# EAGLE design BIM power supply (EAGLE 5.12)
DATABASE: ../../../../Component-libraries/partsdb.txt; PARTNO: 282836-2

## Sheet 1 of 5
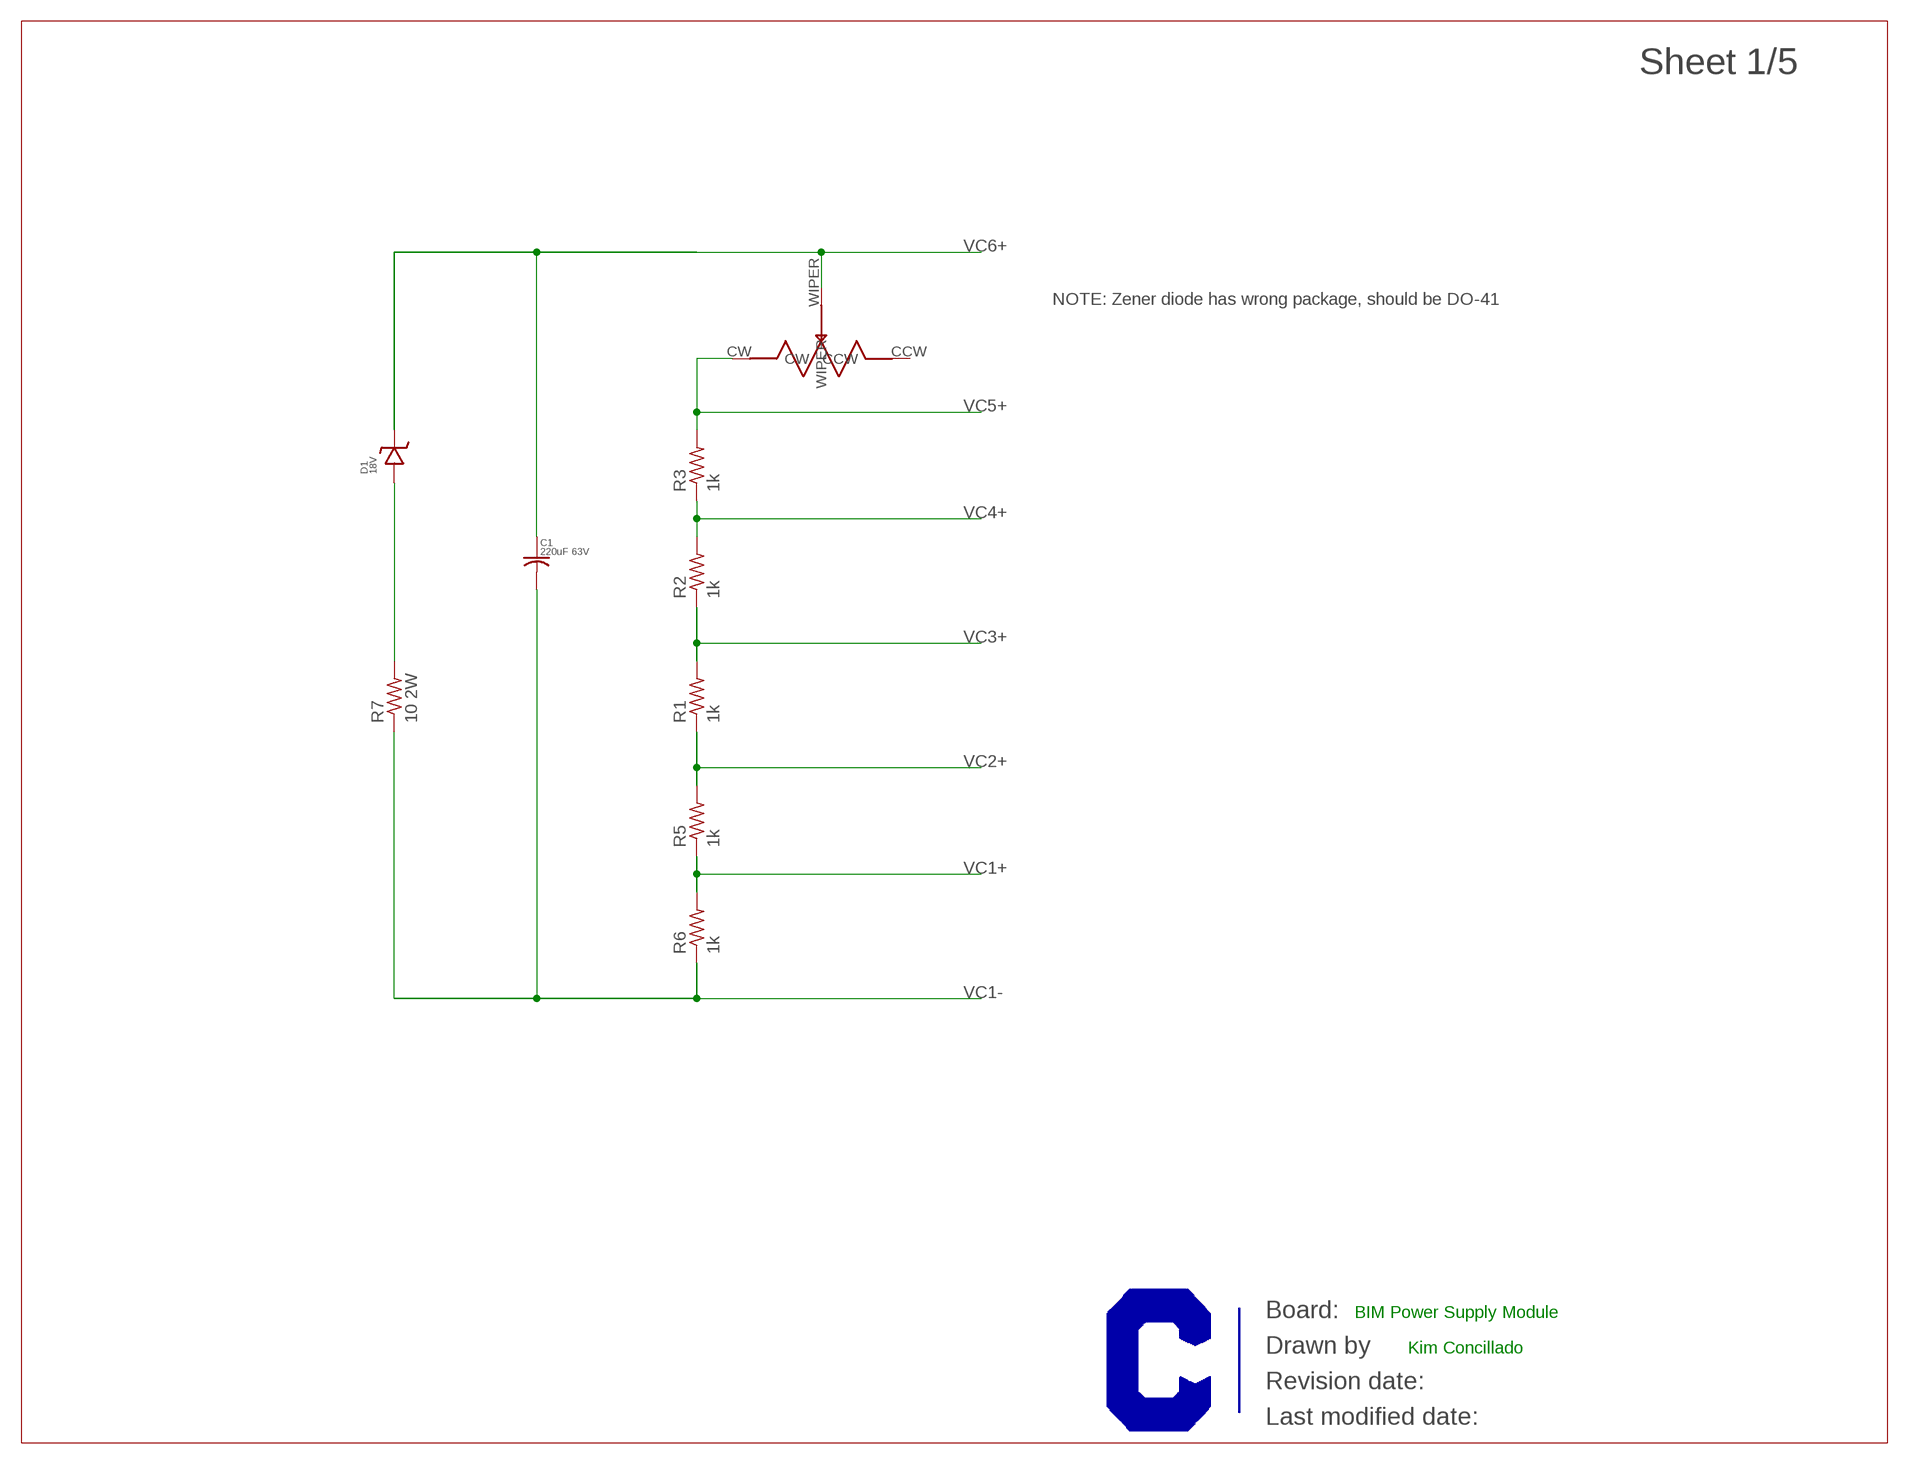
[diagram p0: schematic, sheet 1]

### Parts
C1  220uF 63V  C-US050-100X160  [C050-100X160]
D1  18V  ZENER_DIODE-DO-41  [DO-41]
R1  1k  R-US_R0603  [R0603]
R2  1k  R-US_R0603  [R0603]
R3  1k  R-US_R0603  [R0603]
R5  1k  R-US_R0603  [R0603]
R6  1k  R-US_R0603  [R0603]
R7  10 2W  R-US_0617/17  [0617/17]
U$1  CURRENT-C-LETTER-LANDSCAPE  [BLANK]
U$7  3362P-103LF-ND  [3362P-103LF-ND_THROUGH_HOLE]

### Nets
N$8: D1.ANODE R7.2
VC1+: R5.1 R6.2 ; also sheet 5
VC1-: C1.CATHODE R6.1 R7.1 ; also sheet 5
VC2+: R1.1 R5.2 ; also sheet 5
VC3+: R1.2 R2.1 ; also sheet 5
VC4+: R2.2 R3.1 ; also sheet 5
VC5+: R3.2 U$7.CW ; also sheet 5
VC6+: C1.ANODE D1.CATHODE U$7.WIPER ; also sheet 2,5
Unconnected: U$7.CCW

### Notes on the sheet
- NOTE: Zener diode has wrong package, should be DO-41
- BIM Power Supply Module
- Kim Concillado

## Sheet 2 of 5
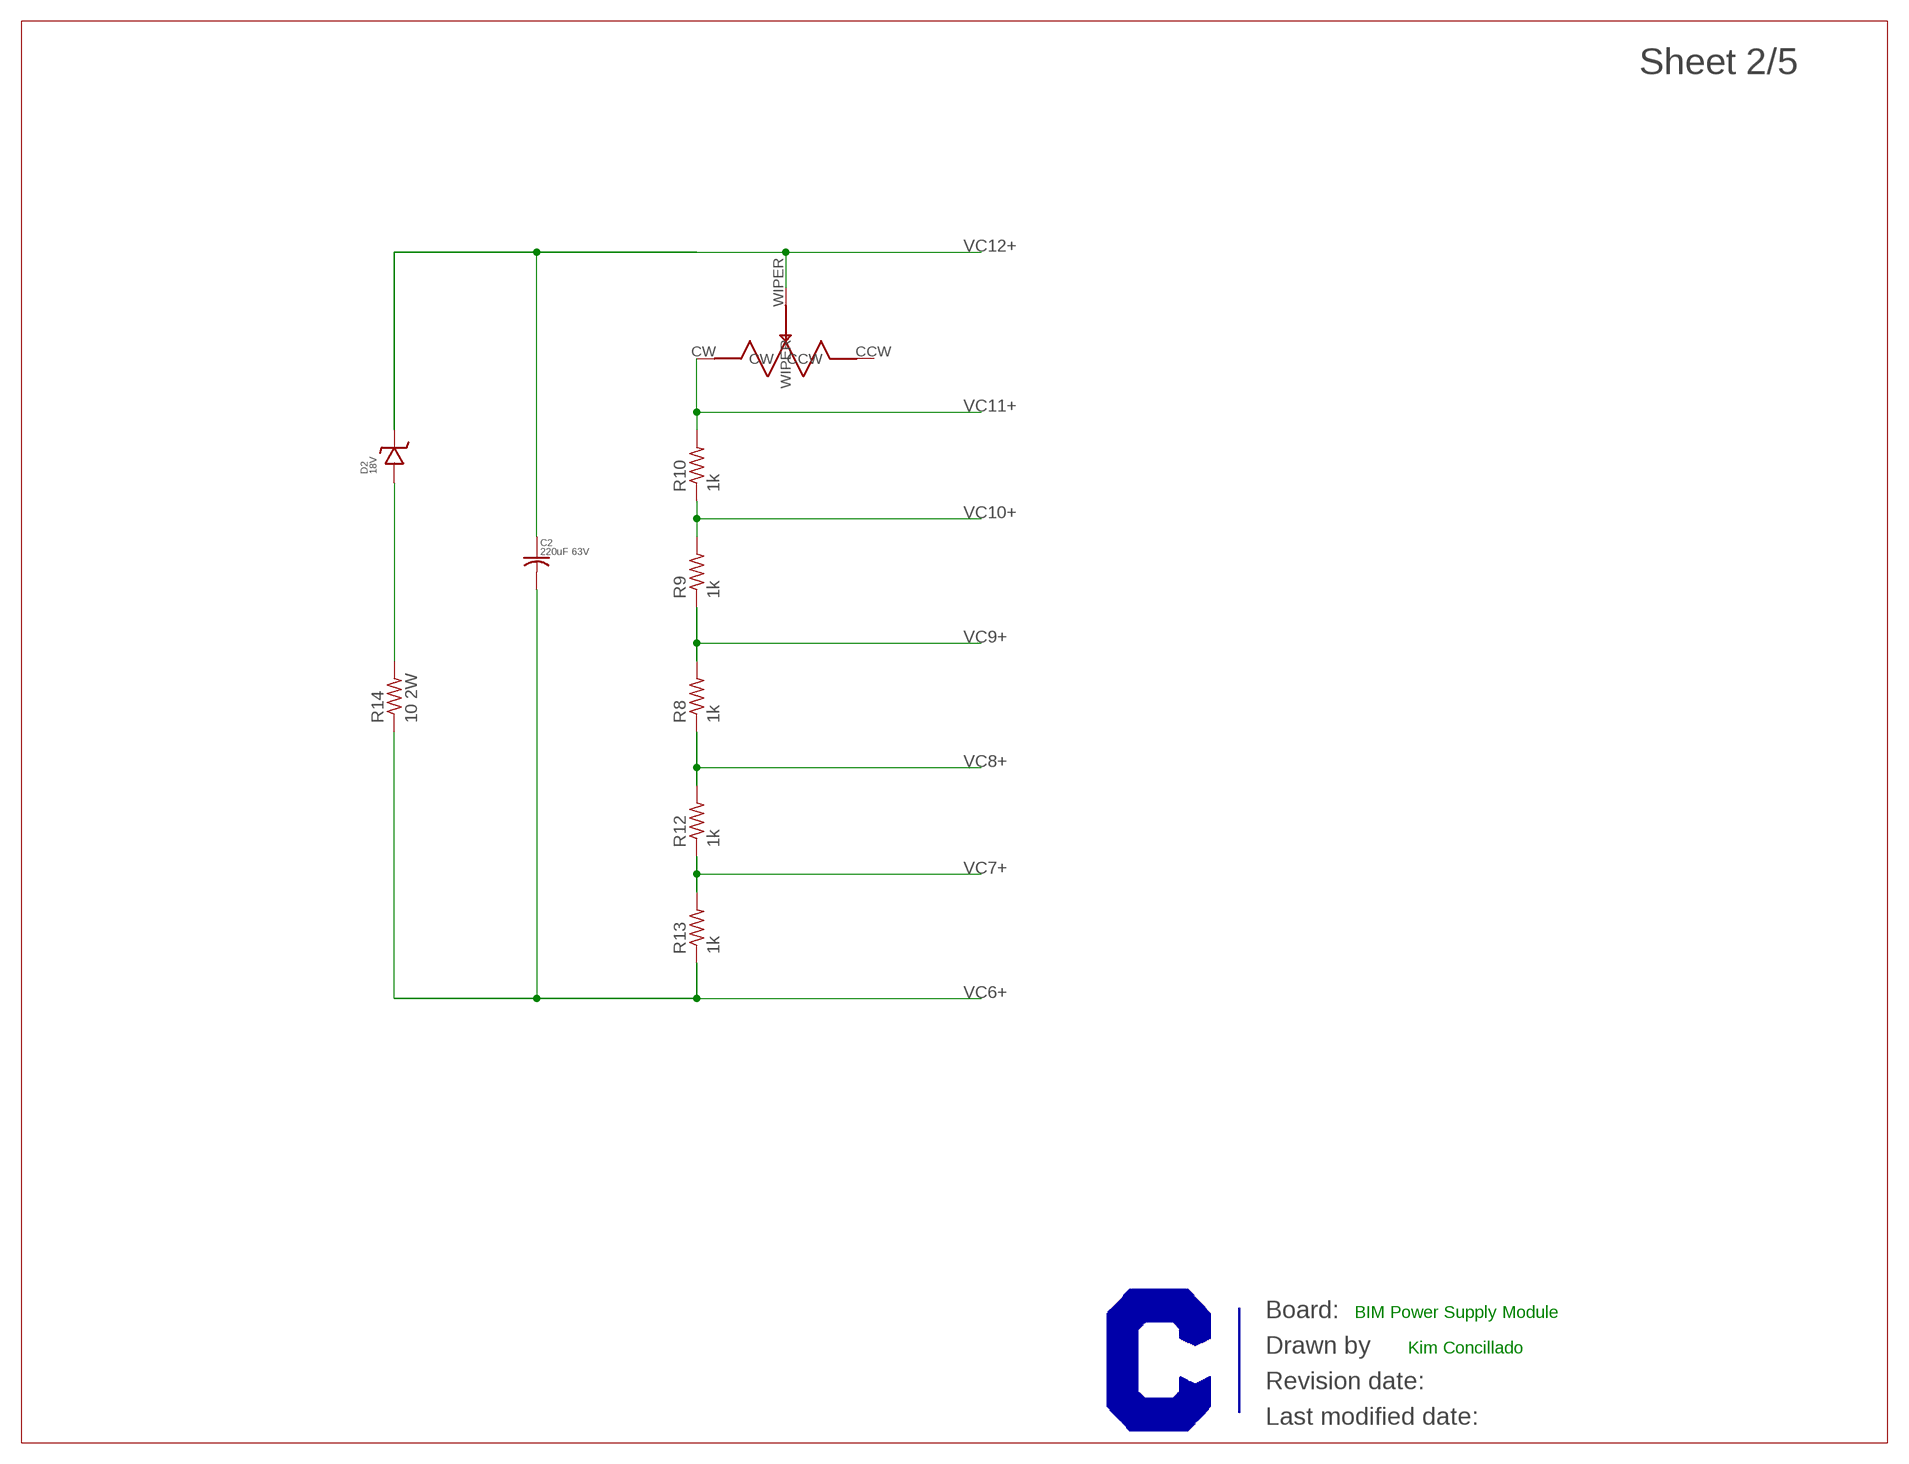
[diagram p1: schematic, sheet 2]

### Parts
C2  220uF 63V  C-US050-100X160  [C050-100X160]
D2  18V  ZENER_DIODE-DO-41  [DO-41]
R8  1k  R-US_R0603  [R0603]
R9  1k  R-US_R0603  [R0603]
R10  1k  R-US_R0603  [R0603]
R12  1k  R-US_R0603  [R0603]
R13  1k  R-US_R0603  [R0603]
R14  10 2W  R-US_0617/17  [0617/17]
U$2  CURRENT-C-LETTER-LANDSCAPE  [BLANK]
U$8  3362P-103LF-ND  [3362P-103LF-ND_THROUGH_HOLE]

### Nets
N$1: D2.ANODE R14.2
VC6+: C2.CATHODE R13.1 R14.1 ; also sheet 1,5
VC7+: R12.1 R13.2 ; also sheet 5
VC8+: R8.1 R12.2 ; also sheet 5
VC9+: R8.2 R9.1 ; also sheet 5
VC10+: R9.2 R10.1 ; also sheet 5
VC11+: R10.2 U$8.CW ; also sheet 5
VC12+: C2.ANODE D2.CATHODE U$8.WIPER ; also sheet 3,5
Unconnected: U$8.CCW

### Notes on the sheet
- BIM Power Supply Module
- Kim Concillado

## Sheet 3 of 5
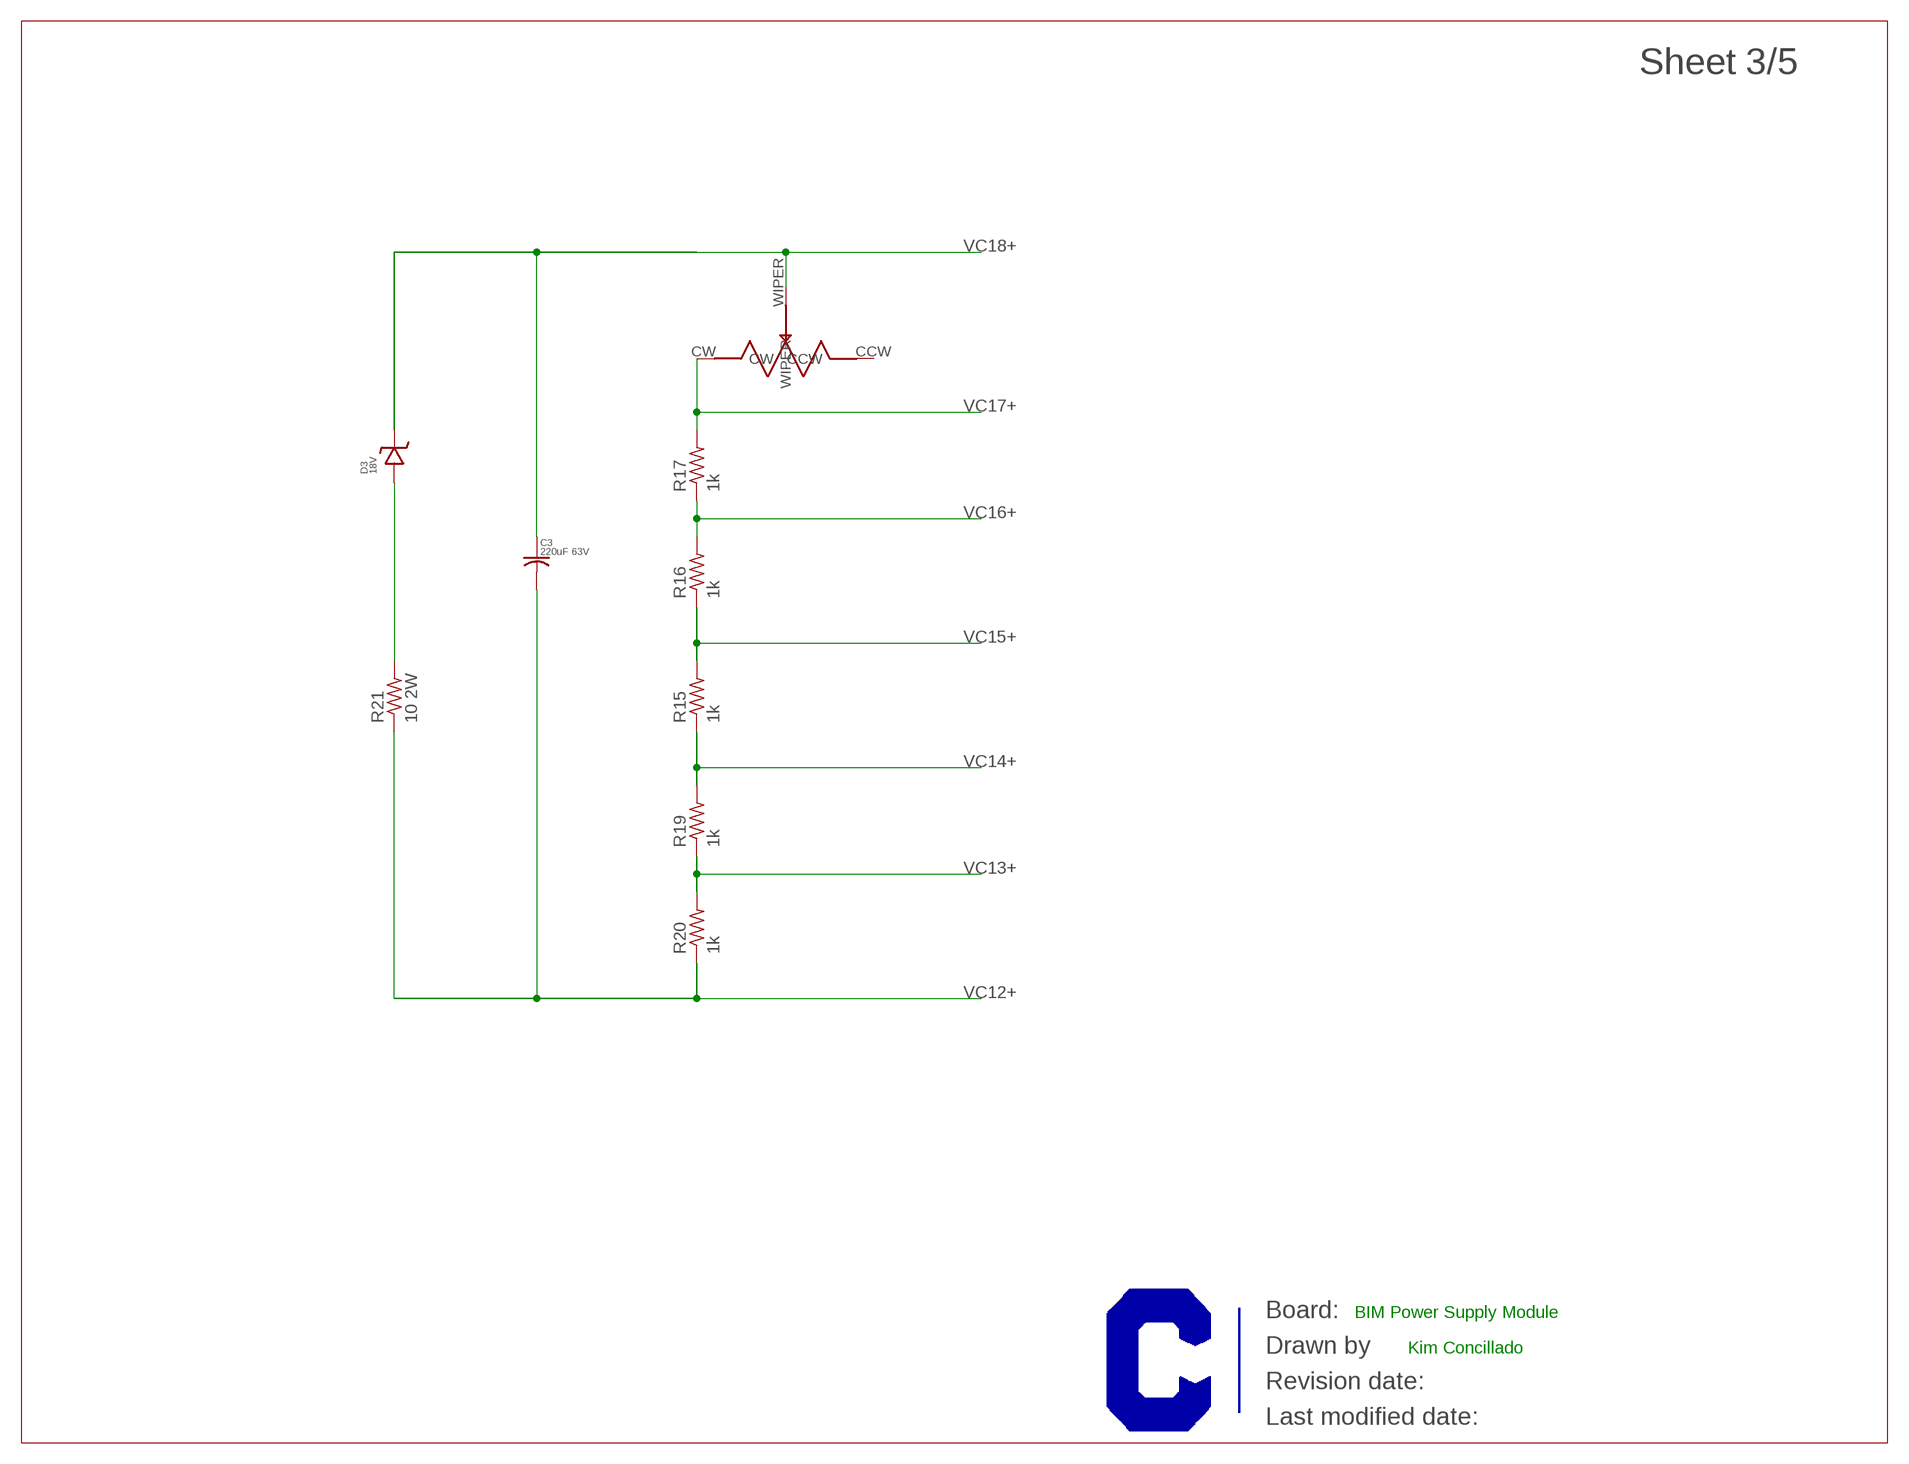
[diagram p2: schematic, sheet 3]

### Parts
C3  220uF 63V  C-US050-100X160  [C050-100X160]
D3  18V  ZENER_DIODE-DO-41  [DO-41]
R15  1k  R-US_R0603  [R0603]
R16  1k  R-US_R0603  [R0603]
R17  1k  R-US_R0603  [R0603]
R19  1k  R-US_R0603  [R0603]
R20  1k  R-US_R0603  [R0603]
R21  10 2W  R-US_0617/17  [0617/17]
U$3  CURRENT-C-LETTER-LANDSCAPE  [BLANK]
U$6  3362P-103LF-ND  [3362P-103LF-ND_THROUGH_HOLE]

### Nets
N$2: D3.ANODE R21.2
VC12+: C3.CATHODE R20.1 R21.1 ; also sheet 2,5
VC13+: R19.1 R20.2 ; also sheet 5
VC14+: R15.1 R19.2 ; also sheet 5
VC15+: R15.2 R16.1 ; also sheet 5
VC16+: R16.2 R17.1 ; also sheet 5
VC17+: R17.2 U$6.CW ; also sheet 5
VC18+: C3.ANODE D3.CATHODE U$6.WIPER ; also sheet 4,5
Unconnected: U$6.CCW

### Notes on the sheet
- BIM Power Supply Module
- Kim Concillado

## Sheet 4 of 5
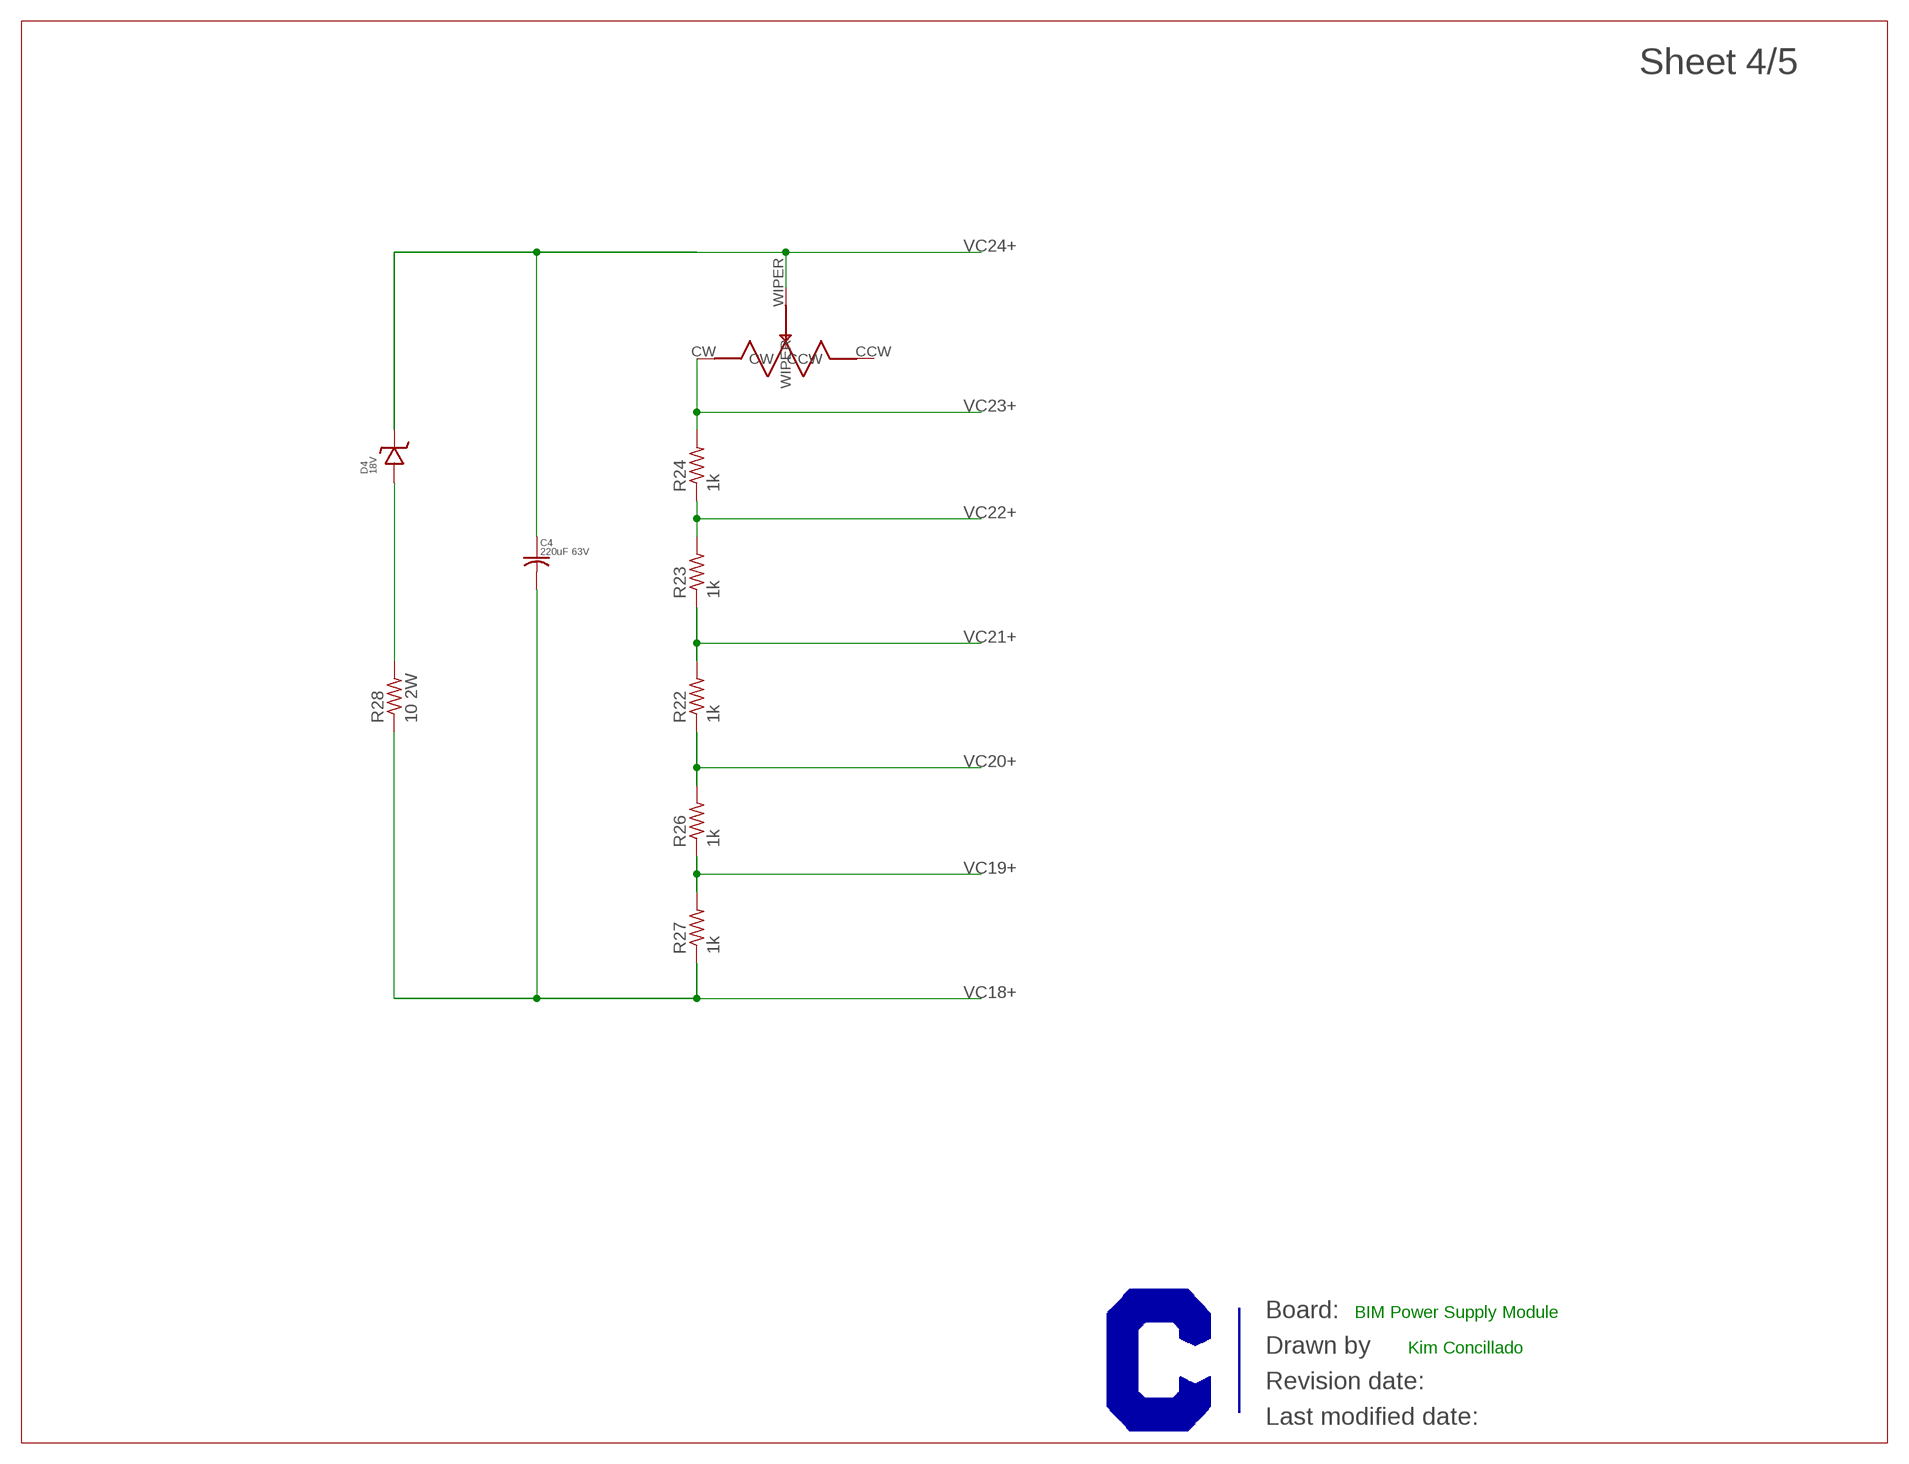
[diagram p3: schematic, sheet 4]

### Parts
C4  220uF 63V  C-US050-100X160  [C050-100X160]
D4  18V  ZENER_DIODE-DO-41  [DO-41]
R22  1k  R-US_R0603  [R0603]
R23  1k  R-US_R0603  [R0603]
R24  1k  R-US_R0603  [R0603]
R26  1k  R-US_R0603  [R0603]
R27  1k  R-US_R0603  [R0603]
R28  10 2W  R-US_0617/17  [0617/17]
U$4  CURRENT-C-LETTER-LANDSCAPE  [BLANK]
U$10  3362P-103LF-ND  [3362P-103LF-ND_THROUGH_HOLE]

### Nets
N$3: D4.ANODE R28.2
VC18+: C4.CATHODE R27.1 R28.1 ; also sheet 3,5
VC19+: R26.1 R27.2 ; also sheet 5
VC20+: R22.1 R26.2 ; also sheet 5
VC21+: R22.2 R23.1 ; also sheet 5
VC22+: R23.2 R24.1 ; also sheet 5
VC23+: R24.2 U$10.CW ; also sheet 5
VC24+: C4.ANODE D4.CATHODE U$10.WIPER ; also sheet 5
Unconnected: U$10.CCW

### Notes on the sheet
- BIM Power Supply Module
- Kim Concillado

## Sheet 5 of 5
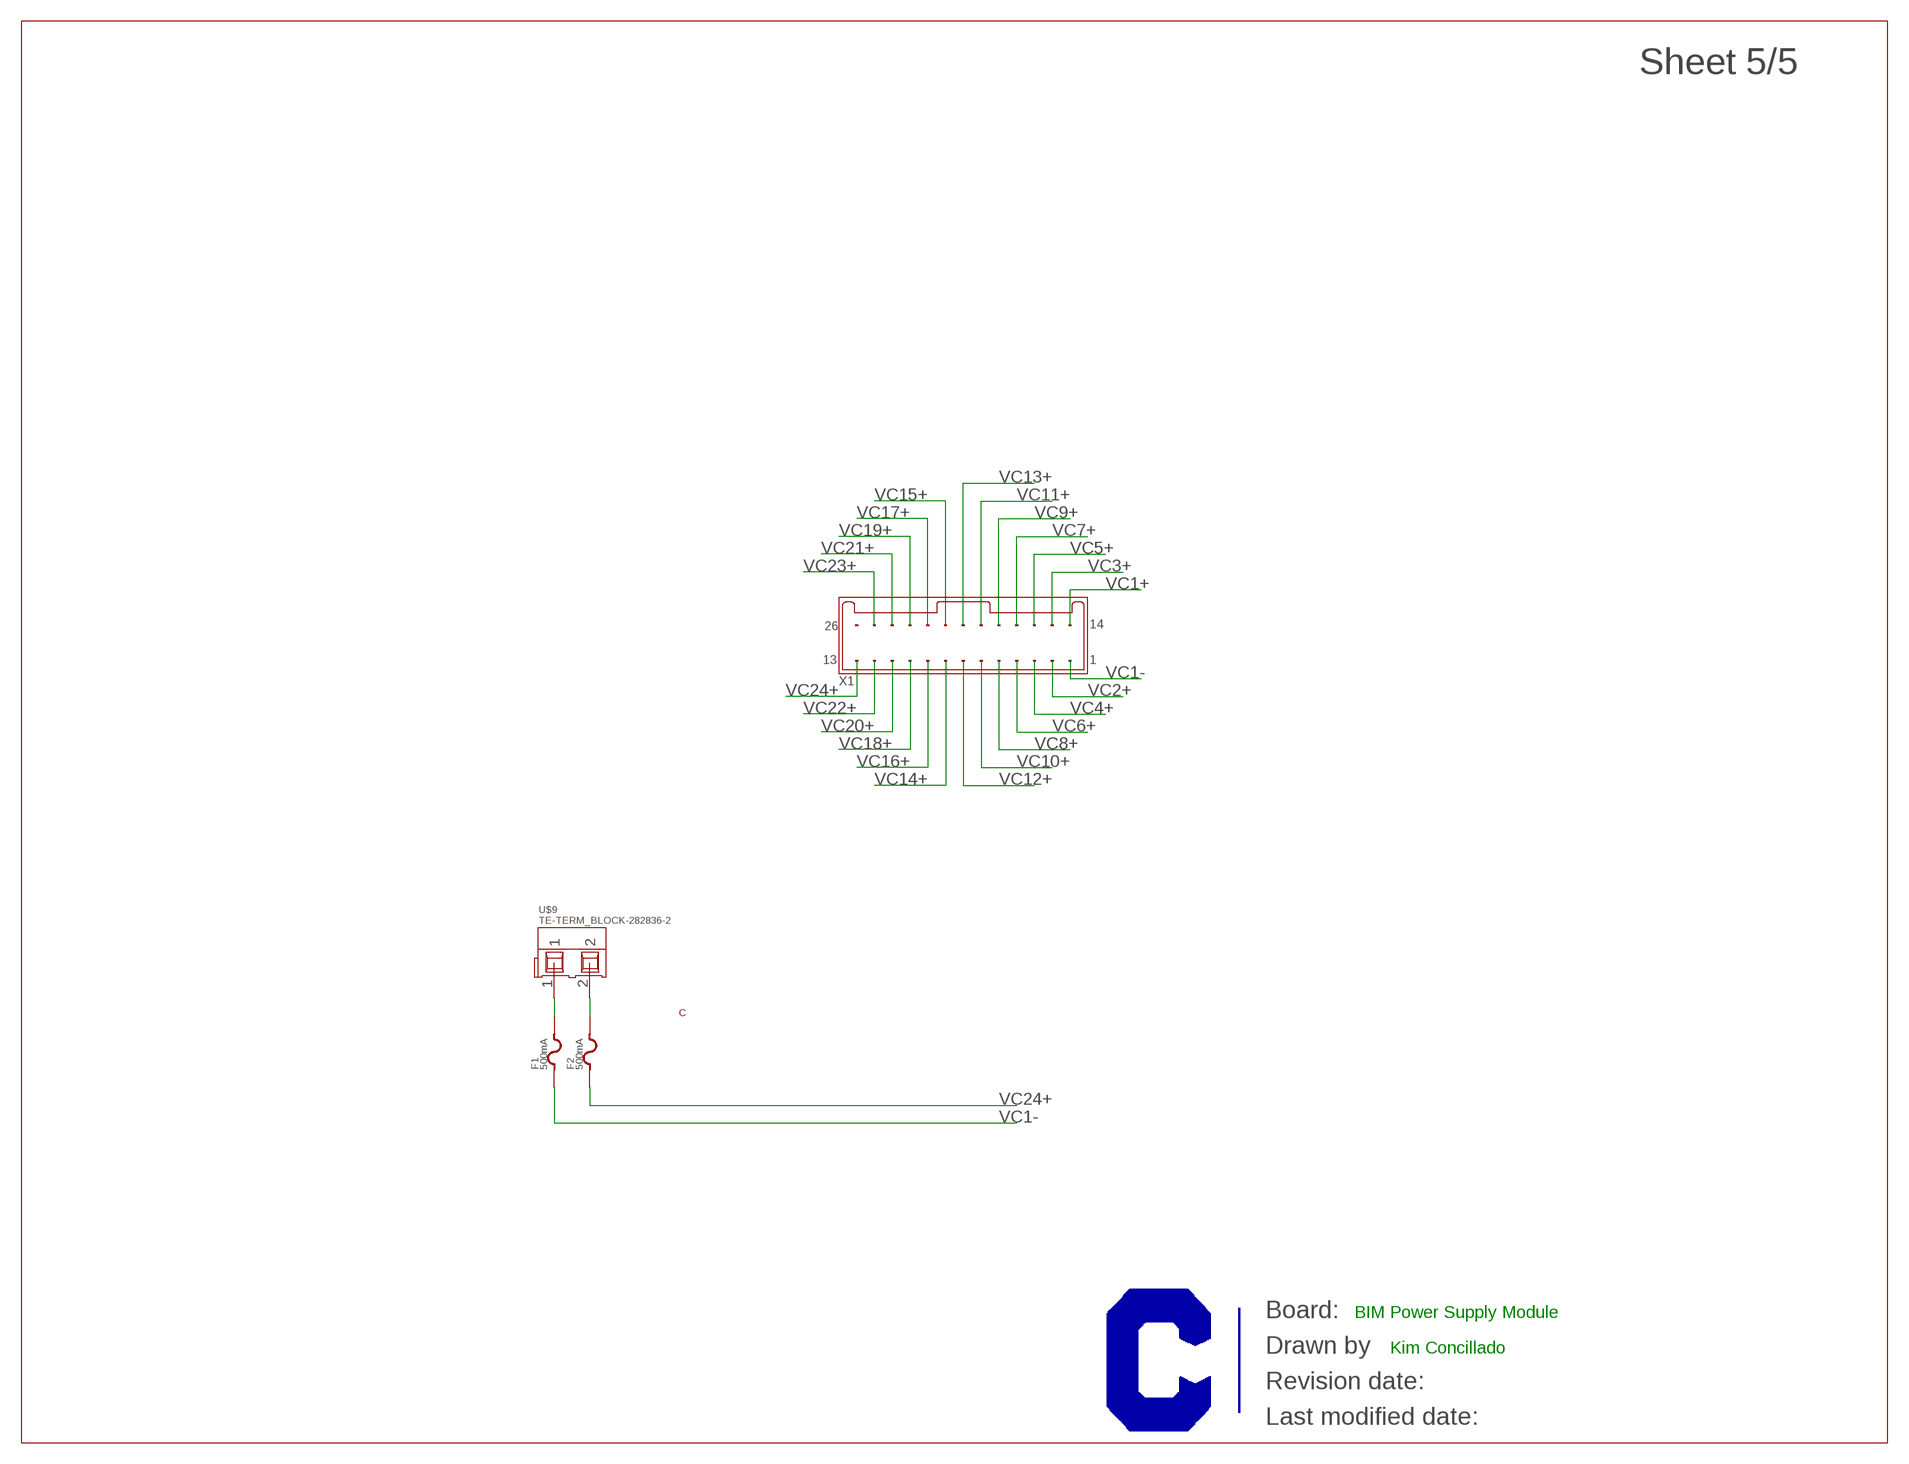
[diagram p4: schematic, sheet 5]

### Parts
F1  500mA  FUSE-1206  [1206]
F2  500mA  FUSE-1206  [1206]
U$5  CURRENT-C-LETTER-LANDSCAPE  [BLANK]
U$9  TE-TERM_BLOCK-282836-2  [TERMINAL_BLOCK_282836-2]
U$11  CURRENT-LOGO-0.25"  [CURRENT-0.25"]
X1  MICROCLASP-26-DUAL-RA  [MICROCLASP-26-DUAL-RA]

### Nets
N$4: F1.2 U$9.1
N$5: F2.2 U$9.2
VC1+: X1.14 ; also sheet 1
VC1-: F1.1 X1.1 ; also sheet 1
VC2+: X1.2 ; also sheet 1
VC3+: X1.15 ; also sheet 1
VC4+: X1.3 ; also sheet 1
VC5+: X1.16 ; also sheet 1
VC6+: X1.4 ; also sheet 1,2
VC7+: X1.17 ; also sheet 2
VC8+: X1.5 ; also sheet 2
VC9+: X1.18 ; also sheet 2
VC10+: X1.6 ; also sheet 2
VC11+: X1.19 ; also sheet 2
VC12+: X1.7 ; also sheet 2,3
VC13+: X1.20 ; also sheet 3
VC14+: X1.8 ; also sheet 3
VC15+: X1.21 ; also sheet 3
VC16+: X1.9 ; also sheet 3
VC17+: X1.22 ; also sheet 3
VC18+: X1.10 ; also sheet 3,4
VC19+: X1.23 ; also sheet 4
VC20+: X1.11 ; also sheet 4
VC21+: X1.24 ; also sheet 4
VC22+: X1.12 ; also sheet 4
VC23+: X1.25 ; also sheet 4
VC24+: F2.1 X1.13 ; also sheet 4
Unconnected: X1.26

### Notes on the sheet
- BIM Power Supply Module
- Kim Concillado

## Library data of the parts
C1-C4 = rcl_current:C-US: CAPACITOR, American symbol
D1-D4 = Diodes:ZENER_DIODE
F1 F2 = Fuses:FUSE
R1-R3 R5-R10 R12-R17 R19-R24 R26-R28 = rcl:R-US_: RESISTOR, American symbol
U$1-U$5 = Frames:CURRENT-C-LETTER-LANDSCAPE; BOM: EXCLUDE
U$6-U$8 U$10 = Bourns:3362P-103LF-ND: 10 K Trimpot, 1 Turn
U$9 = TE-Aaron:TE-TERM_BLOCK-282836-2
U$11 = Logos:CURRENT-LOGO; BOM: EXCLUDE
X1 = Molex:MICROCLASP-26-DUAL: MicroClasp header, dual-row, 26 circuits; PARTNO: 55959-2630

## Board
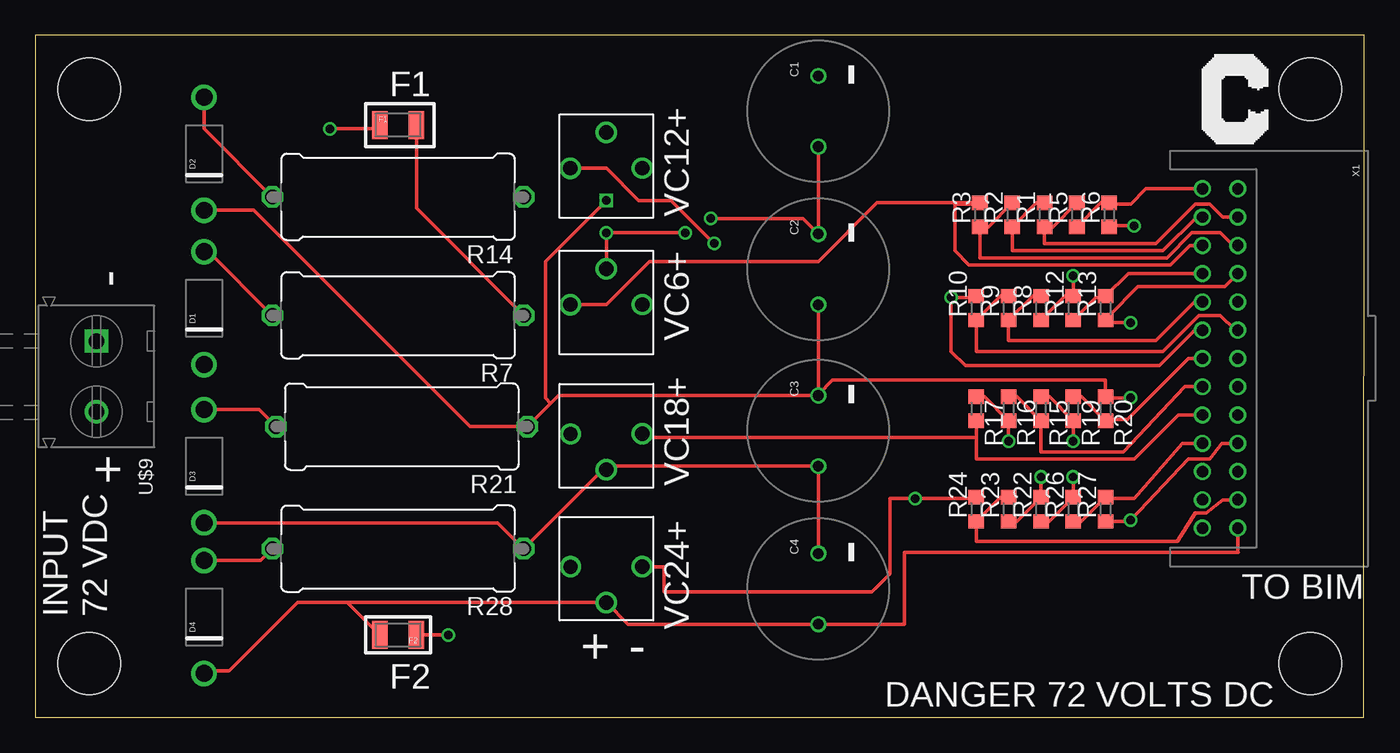
[diagram p5: board, top side]
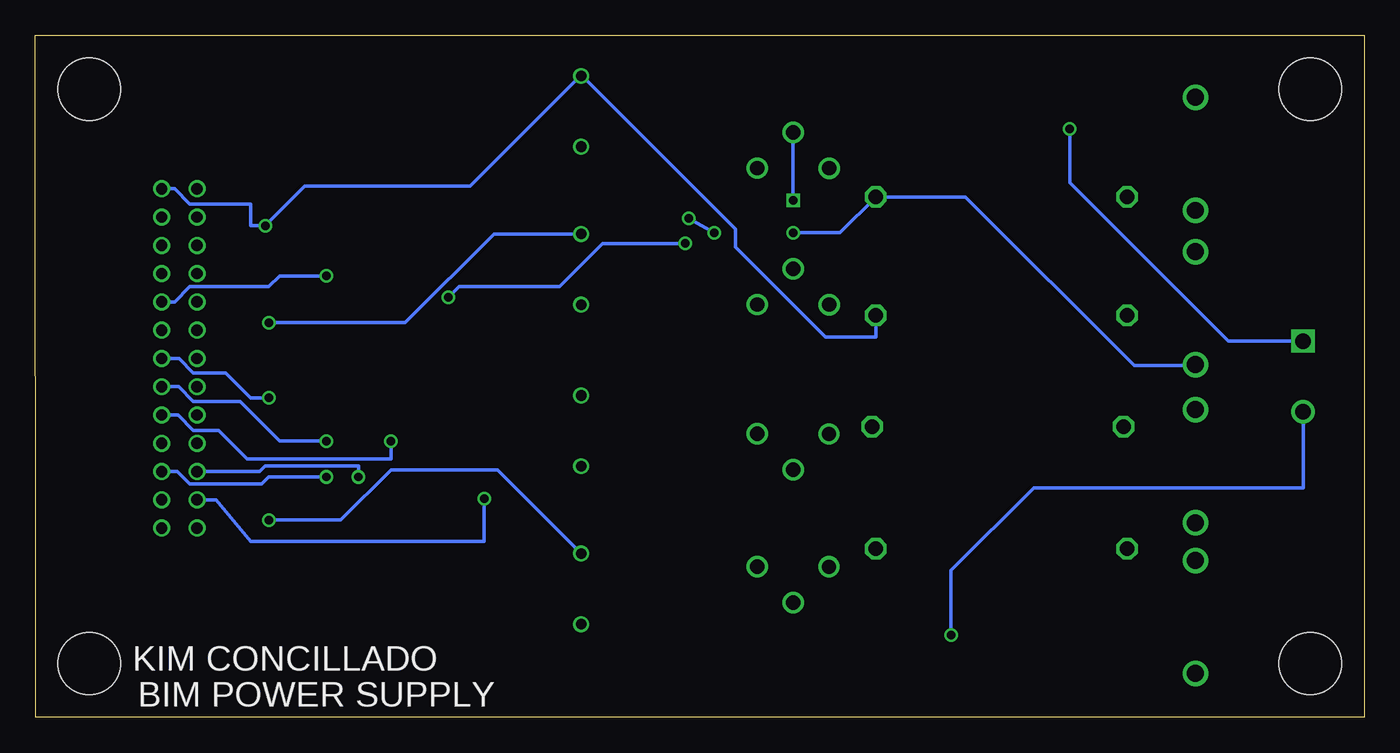
[diagram p6: board, bottom side, seen from below]

Size 93.98 x 48.26 mm. Coordinates in mm from the lower left corner, seen from the top.
Outline: 0,0 93.96,0 93.98,48.26 0,48.26 0,0
Copper layers (1*16): Top 0.0356mm / dielectric 1.5011mm / Bottom 0.0356mm
Design rules "OSH Park 2-layer": minimum track width 6mil, minimum drill 13mil, track to track 6mil, track to pad 6mil, pad to pad 6mil, via to via 6mil, smd to smd 6mil, copper to edge 15mil, drill to drill 6mil, minimum pad ring 7mil, minimum via ring 7mil, stop-mask expansion 4mil, vias tented up to drill 0mil, thermal gap 10mil
Holes 4.4 mm at 3.81,44.45 3.81,3.81 90.17,3.81 90.17,44.45

### Footprints (pad centres in the part's own frame; a part is rotated, then mirrored left to right if it is on the bottom)
C050-100X160 = drill 0.75 round: ANODE 0,0; CATHODE -5,0
DO-41 = drill 1.2 round: ANODE 4,0; CATHODE -4,0
1206 = smd 1.1 x 2: 1 1.3,0; 2 -1.3,0
R0603 = smd 1 x 1.1: 1 -0.85,0; 2 0.85,0
0617/17 = drill 1.016 octagon: 1 -8.89,0; 2 8.89,0
3362P-103LF-ND_THROUGH_HOLE = drill 1 round: CCW -2.54,2.54 | drill 1.016 round: CW 2.54,2.54; WIPER 0,0
TERMINAL_BLOCK_282836-2 = drill 1.1 square: 1 -2.5,0 | drill 1.1 round: 2 2.5,0
MICROCLASP-26-DUAL-RA = drill 0.8 round: 1 -12,2.5; 2 -10,2.5; 3 -8,2.5; 4 -6,2.5; 5 -4,2.5; 6 -2,2.5; 7 0,2.5; 8 2,2.5; 9 4,2.5; 10 6,2.5; 11 8,2.5; 12 10,2.5; 13 12,2.5; 14 -12,0; 15 -10,0; 16 -8,0; 17 -6,0; 18 -4,0; 19 -2,0; 20 0,0; 21 2,0; 22 4,0; 23 6,0; 24 8,0; 25 10,0; 26 12,0

### Placement (x,y rotation side)
C1  55.37,40.39 270 top
C2  55.37,29.21 270 top
C3  55.37,17.78 270 top
C4  55.37,6.6 270 top
D1  11.94,28.96 90 top
D2  11.94,39.88 90 top
D3  11.94,17.78 90 top
D4  11.94,7.11 90 top
F1  25.65,41.91 0 top
F2  25.65,5.84 180 top
R1  71.37,35.56 90 top
R2  69.09,35.56 90 top
R3  66.8,35.56 90 top
R5  73.66,35.56 90 top
R6  75.95,35.56 90 top
R7  25.65,28.45 180 top
R8  71.12,28.96 90 top
R9  68.83,28.96 90 top
R10  66.55,28.96 90 top
R12  73.41,28.96 90 top
R13  75.69,28.96 90 top
R14  25.65,36.83 180 top
R15  71.12,21.84 270 top
R16  68.83,21.84 270 top
R17  66.55,21.84 270 top
R19  73.41,21.84 270 top
R20  75.69,21.84 270 top
R21  25.91,20.57 180 top
R22  71.12,14.73 90 top
R23  68.83,14.73 90 top
R24  66.55,14.73 90 top
R26  73.41,14.73 90 top
R27  75.69,14.73 90 top
R28  25.65,11.94 180 top
U$1  -107.95,39.37 0 top  (outside the outline)
U$2  -110.49,39.37 0 top  (outside the outline)
U$3  -113.03,39.37 0 top  (outside the outline)
U$4  -115.57,39.37 0 top  (outside the outline)
U$5  -118.11,39.37 0 top  (outside the outline)
U$6  40.39,17.53 0 top
U$7  40.39,31.75 180 top
U$8  40.39,41.4 180 top
U$9  4.32,24.13 270 top
U$10  40.39,8.13 0 top
U$11  82.55,40.64 0 top
X1  82.55,25.4 270 top

### Tracks (layer width: path | path; a pad name or v marks a point on that pad's centre or on a via)
N$1
  Top 0.254: D2.ANODE 11.94,41.66 R14.2
N$2
  Top 0.254: D3.ANODE 15.81,21.78 R21.2
N$3
  Top 0.254: D4.ANODE 15.94,11.11 R28.2
N$4  (via drill 0.6)
  Top 0.254: v20.83,41.66 24.1,41.66 F1.2
  Bottom 0.254: U$9.1 9.61,26.63 20.83,37.85 v20.83,41.66
N$5  (via drill 0.6)
  Top 0.254: F2.2 v29.21,5.84
  Bottom 0.254: v29.21,5.84 29.21,10.41 23.37,16.26 4.32,16.26 U$9.2
N$8
  Top 0.254: D1.ANODE 12.26,32.96 R7.2
VC1+
  Top 0.254: X1.14 78.55,37.4 77.47,36.32 76.03,36.32 R6.2 75.36,36.41 R5.1
VC1-  (via drill 0.6)
  Top 0.254: v77.72,34.8 76.03,34.8 R6.1 | F1.1 26.95,36.04 R7.1
  Bottom 0.254: X1.1 84.14,37.4 83.06,36.32 78.74,36.32 78.74,34.8 v77.72,34.8 74.93,37.59 63.25,37.59 55.45,45.39 C1.CATHODE 55.29,45.39 44.45,34.54 44.45,33.27 38.1,26.92 34.54,26.92 R7.1
VC2+
  Top 0.254: R5.2 71.96,34.71 R1.1 71.37,33.53 79.25,33.53 82.04,36.32 83.06,36.32 83.98,35.4 X1.2
VC3+
  Top 0.254: X1.15 82.14,35.4 79.76,33.02 69.09,33.02 R2.1 70.79,36.41 R1.2
VC4+
  Top 0.254: R2.2 67.39,34.71 R3.1 66.8,32.51 80.01,32.51 81.79,34.29 83.82,34.29 84.71,33.4 X1.3
VC5+
  Top 0.254: X1.16 81.66,33.4 80.26,32 66.04,32 65.02,33.02 65.02,36.32 66.71,36.32 R3.2 59.52,36.41 55.37,32.26 43.43,32.26 40.39,29.21 U$7.CW
VC6+  (via drill 0.6)
  Top 0.254: X1.4 84.13,30.48 77.98,30.48 75.95,28.45 R13.1 75.86,27.94 v77.47,27.94 | C1.ANODE C2.CATHODE 54.28,35.31 v47.75,35.31 | U$7.WIPER v40.39,34.29 v45.97,34.29
  Bottom 0.254: C2.CATHODE 61.55,34.21 67.82,27.94 v77.47,27.94 | v40.39,34.29 37.08,34.29 R14.1 28.19,36.83 16.26,24.89 12,24.89 D1.CATHODE | v45.97,34.29 v47.75,35.31
VC7+
  Top 0.254: 73.24,28.19 R12.1 75.02,29.72 75.69,29.72 R13.2 77.29,31.4 X1.17
VC8+  (via drill 0.6)
  Top 0.254: R8.1 72.82,29.81 R12.2 v73.41,31.24
  Bottom 0.254: X1.5 84.14,29.4 83.06,30.48 77.47,30.48 76.71,31.24 v73.41,31.24
VC9+
  Top 0.254: R8.2 70.53,29.81 R9.1 68.83,26.67 79.25,26.67 81.98,29.4 X1.18
VC10+
  Top 0.254: R9.2 68.25,29.81 R10.1 66.55,25.91 79.76,25.91 82.3,28.45 83.82,28.45 84.87,27.4 X1.6
VC11+  (via drill 0.6)
  Top 0.254: X1.19 82.01,27.4 79.5,24.89 65.79,24.89 64.77,25.91 64.77,29.46 v64.77,29.72 66.46,29.72 R10.2 | U$8.CW 40.39,38.86 42.67,36.58 44.96,36.58 v48.01,33.53
  Bottom 0.254: v48.01,33.53 53.85,33.53 56.9,30.48 64.01,30.48 v64.77,29.72
VC12+  (via drill 0.6)
  Top 0.254: v77.47,22.61 75.78,22.61 R20.1 75.69,23.88 56.39,23.88 55.37,22.86 C3.CATHODE | C3.CATHODE C2.ANODE | 36.45,22.23 R21.1 30.73,20.57 15.43,35.88 D2.CATHODE | 36.45,22.23 37,22.78 C3.CATHODE | v40.39,36.58 36.07,32.26 36.07,22.61 36.45,22.23
  Bottom 0.254: X1.7 83.82,25.4 82.8,24.38 80.52,24.38 78.74,22.61 v77.47,22.61 | v40.39,36.58 U$8.WIPER
VC13+
  Top 0.254: X1.20 81.53,25.4 77.22,21.08 75.78,21.08 R20.2 73.99,22.69 R19.1
VC14+  (via drill 0.6)
  Top 0.254: R15.1 71.71,22.69 R19.2 v73.41,19.56
  Bottom 0.254: X1.8 83.85,23.4 82.8,22.35 79.5,22.35 76.71,19.56 v73.41,19.56
VC15+
  Top 0.254: R16.1 69.42,22.69 R15.2 71.12,18.8 76.96,18.8 81.31,23.4 X1.21
VC16+  (via drill 0.6)
  Top 0.254: R17.1 67.13,22.69 R16.2 v68.83,19.56
  Bottom 0.254: X1.9 83.88,21.4 82.8,20.32 81.03,20.32 78.99,18.29 68.83,18.29 v68.83,19.56
VC17+
  Top 0.254: X1.22 80.84,21.4 77.72,18.29 66.55,18.29 66.55,19.81 | 66.55,19.81 R17.2 | U$6.CW 43.18,19.81 66.55,19.81
VC18+  (via drill 0.6)
  Top 0.254: X1.10 83.92,19.4 83.06,18.29 81.53,18.29 v77.47,13.97 77.38,13.88 R27.1 75.78,13.97 | C4.CATHODE C3.ANODE 40.64,17.78 U$6.WIPER 40.13,17.53 R28.1 32.7,13.78 D3.CATHODE
  Bottom 0.254: C4.CATHODE 61.29,17.53 68.83,17.53 72.39,13.97 v77.47,13.97
VC19+
  Top 0.254: R26.1 73.99,13.88 R27.2 75.78,15.49 77.72,15.49 81.12,19.4 X1.23
VC20+  (via drill 0.6)
  Top 0.254: R22.1 71.71,13.88 R26.2 v73.41,17.02
  Bottom 0.254: X1.11 83.95,17.4 83.06,16.51 77.98,16.51 77.47,17.02 v73.41,17.02
VC21+  (via drill 0.6)
  Top 0.254: R23.1 69.42,13.88 R22.2 v71.12,17.02
  Bottom 0.254: X1.24 78.1,17.4 77.72,17.78 71.12,17.78 v71.12,17.02
VC22+
  Top 0.254: X1.12 83.98,15.4 82.8,14.48 82.04,14.48 80.77,12.45 66.55,12.45 R24.1 68.25,15.58 R23.2
VC23+  (via drill 0.6)
  Top 0.254: R24.2 66.46,15.49 v62.23,15.49 60.45,15.49 60.45,10.16 59.18,8.89 44.45,8.89 44.45,10.67 U$10.CW
  Bottom 0.254: X1.25 81.19,15.4 78.74,12.45 62.23,12.45 v62.23,15.49
VC24+
  Top 0.254: X1.13 85.05,11.72 85.09,11.68 61.47,11.68 61.47,6.6 C4.ANODE 41.91,6.6 U$10.WIPER 22.07,8.13 | D4.CATHODE 12.13,3.3 13.72,3.3 18.54,8.13 22.07,8.13 | 22.07,8.13 F2.1

### Text on the board
tPlace: F1 | VC12+ | VC6+ | - | VC18+ | + | VC24+ | TO BIM | INPUT | 72 VDC | + | - | F2 | DANGER 72 VOLTS DC
bPlace: KIM CONCILLADO | BIM POWER SUPPLY